# EAGLE design HackFFM-Duino Chime (EAGLE 7.4.0)
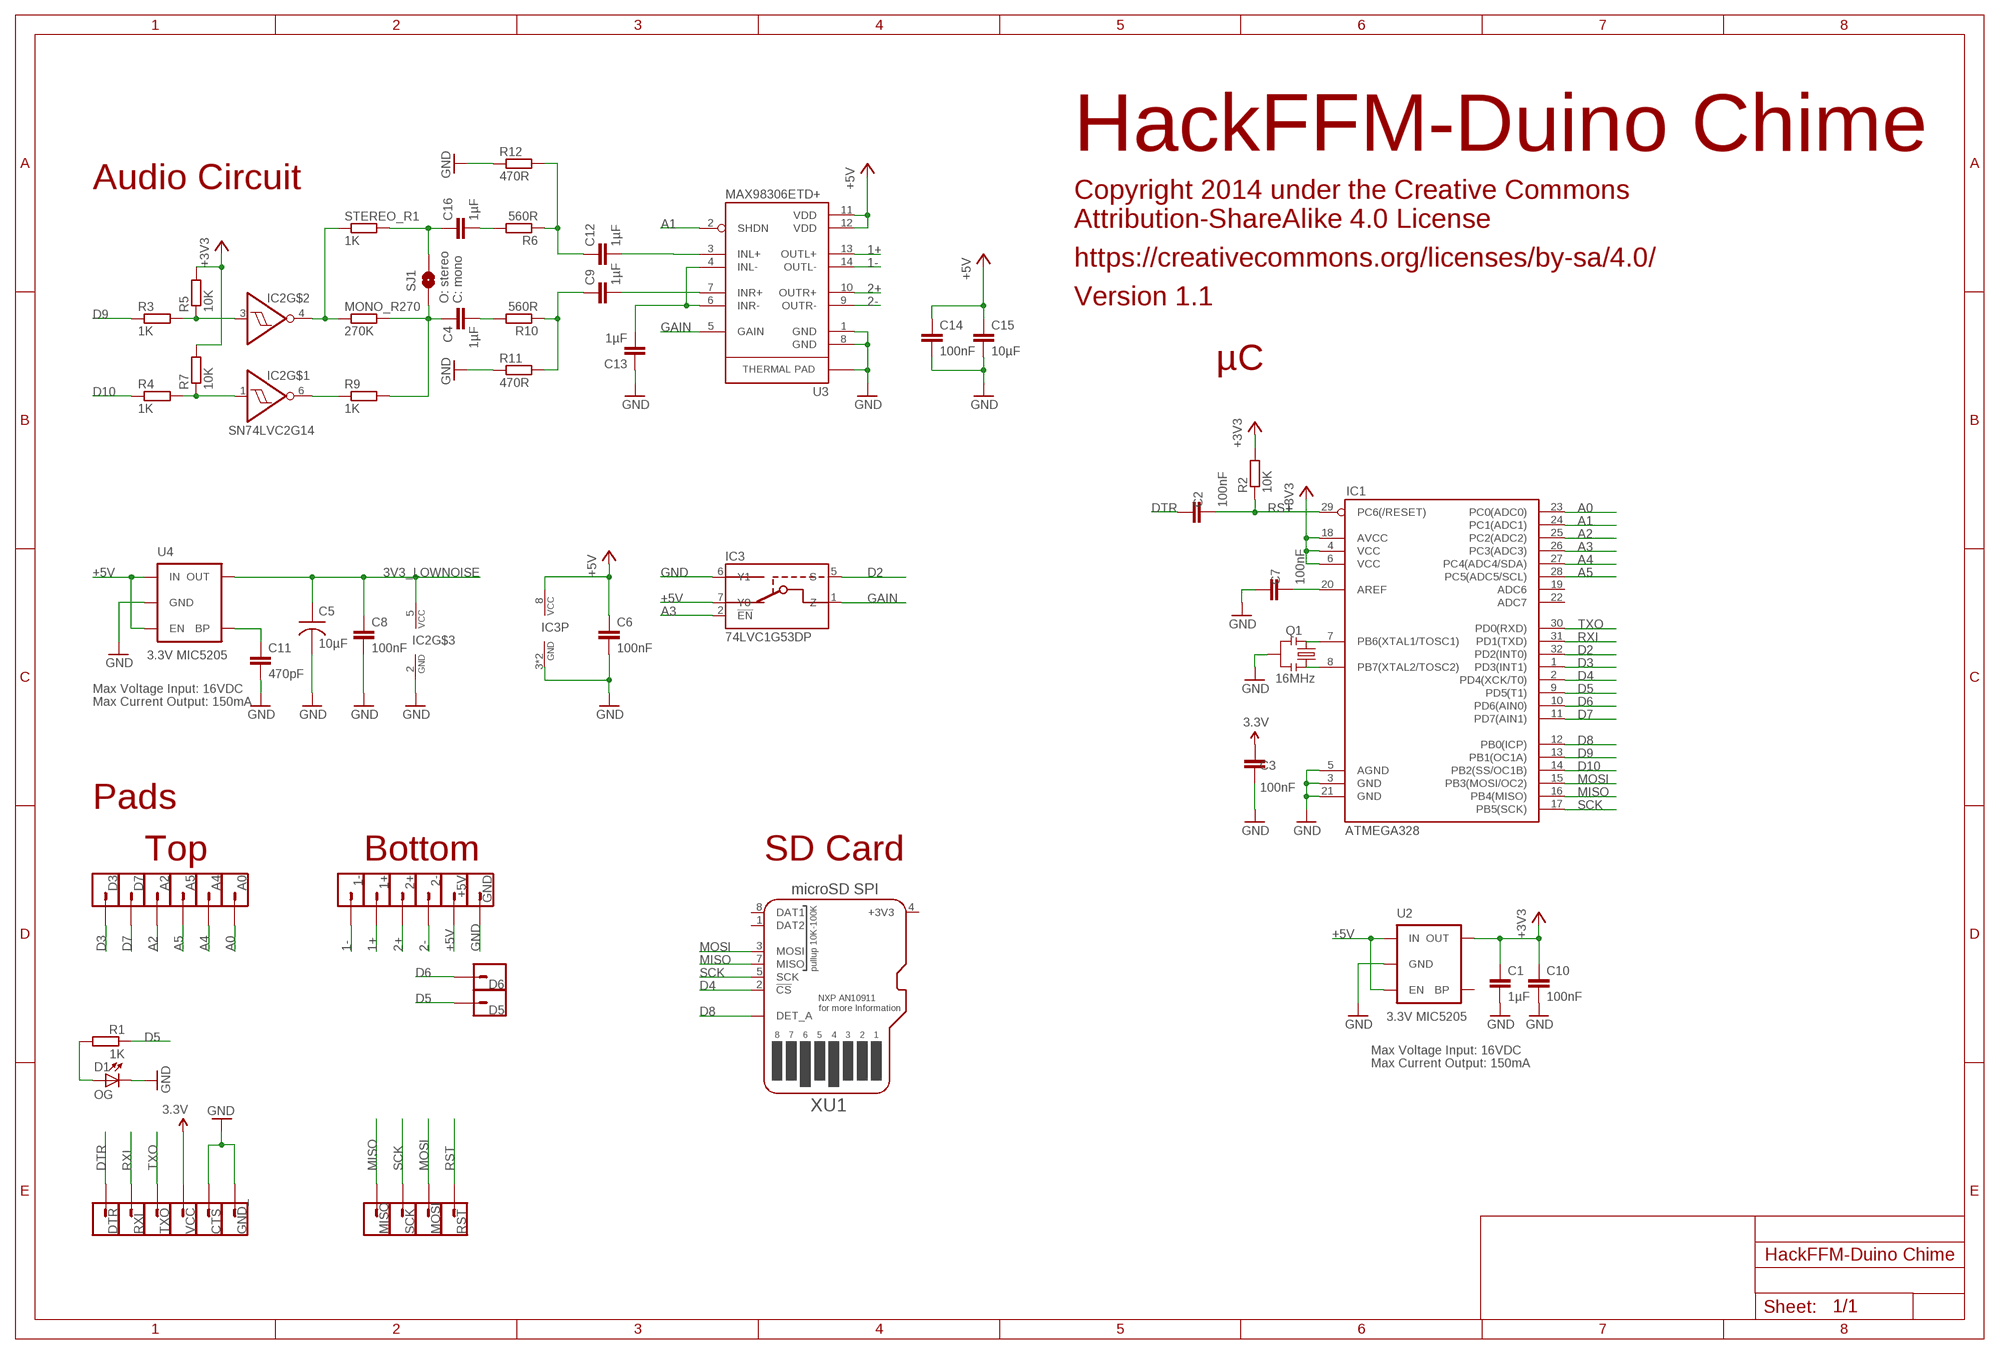
[diagram p0: schematic, sheet 1]

## Parts
1+  M01M01_SMD_EDGE_SHORT  [M01_SMD_EDGE_SHORT]
1-  M01M01_SMD_EDGE_SHORT  [M01_SMD_EDGE_SHORT]
2+  M01M01_SMD_EDGE_SHORT  [M01_SMD_EDGE_SHORT]
2-  M01M01_SMD_EDGE_SHORT  [M01_SMD_EDGE_SHORT]
+5V  M01M01_SMD_EDGE_SHORT  [M01_SMD_EDGE_SHORT]
A0  M01M01_SMD_EDGE_SHORT  [M01_SMD_EDGE_SHORT]
A2  M01M01_SMD_EDGE_SHORT  [M01_SMD_EDGE_SHORT]
A4  M01M01_SMD_EDGE_SHORT  [M01_SMD_EDGE_SHORT]
A5  M01M01_SMD_EDGE_SHORT  [M01_SMD_EDGE_SHORT]
C1  1µF  C-EUC0402  [C0402]
C2  100nF  C-EUC0402  [C0402]
C3  100nF  C-EUC0402  [C0402]
C4  1µF  C-EUC0402  [C0402]
C5  10µF  CAP-TANA-P  [TAN-A]
C6  100nF  C-EUC0402  [C0402]
C7  100nF  C-EUC0402  [C0402]
C8  100nF  C-EUC0402  [C0402]
C9  1µF  C-EUC0402  [C0402]
C10  100nF  C-EUC0402  [C0402]
C11  470pF  C-EUC0402  [C0402]
C12  1µF  C-EUC0402  [C0402]
C13  1µF  C-EUC0402  [C0402]
C14  100nF  C-EUC0402  [C0402]
C15  10µF  C-EUC0805  [C0805]
C16  1µF  C-EUC0402  [C0402]
CTS  M01M01_SMD_EDGE_XS  [M01_SMD_EDGE_XS]
D1  OG  LED0603  [LED-0603]
D3  M01M01_SMD_EDGE_SHORT  [M01_SMD_EDGE_SHORT]
D5  M01M01_SMD_EDGE_SHORT  [M01_SMD_EDGE_SHORT]
D6  M01M01_SMD_EDGE_SHORT  [M01_SMD_EDGE_SHORT]
D7  M01M01_SMD_EDGE_SHORT  [M01_SMD_EDGE_SHORT]
DTR  M01M01_SMD_EDGE_XS  [M01_SMD_EDGE_XS]
GND  M01M01_SMD_EDGE_SHORT  [M01_SMD_EDGE_SHORT]
GND_  M01M01_SMD_EDGE_XS  [M01_SMD_EDGE_XS]
IC1  ATMEGA328  ATMEGA168  [TQFP32-08]
IC2  SN74LVC2G14  [DCK_(R-PDSO-G6)]
IC3  74LVC1G53DP  [SOT-505-2]
MISO  M01M01_SMD_EDGE_XS  [M01_SMD_EDGE_XS]
MONO_R270  270K  R-EU_R0805  [R0805_NOCREAM]
MOSI  M01M01_SMD_EDGE_XS  [M01_SMD_EDGE_XS]
Q1  16MHz  RESONATORSMD  [RESONATOR-SMD]
R1  1K  R-EU_R0402  [R0402]
R2  10K  R-EU_R0402  [R0402]
R3  1K  R-EU_R0402  [R0402]
R4  1K  R-EU_R0402  [R0402]
R5  10K  R-EU_R0402  [R0402]
R6  560R  R-EU_R0402  [R0402]
R7  10K  R-EU_R0402  [R0402]
R9  1K  R-EU_R0402  [R0402]
R10  560R  R-EU_R0402  [R0402]
R11  470R  R-EU_R0402  [R0402]
R12  470R  R-EU_R0402  [R0402]
RST  M01M01_SMD_EDGE_XS  [M01_SMD_EDGE_XS]
RXI  M01M01_SMD_EDGE_XS  [M01_SMD_EDGE_XS]
SCK  M01M01_SMD_EDGE_XS  [M01_SMD_EDGE_XS]
SJ1  SOLDERJUMPERNO  [SJ_2S-NO]
STEREO_R1  1K  R-EU_R0805  [R0805_NOCREAM]
TXO  M01M01_SMD_EDGE_XS  [M01_SMD_EDGE_XS]
U2  3.3V MIC5205  V_REG_LDOSMD  [SOT23-5]
U3  MAX98306ETD+  [14-TDFN]
U4  3.3V MIC5205  V_REG_LDOSMD  [SOT23-5]
VCC  M01M01_SMD_EDGE_XS  [M01_SMD_EDGE_XS]
XU1  MICROSD_DETMOLEX104031  [MICROSD_MOLEX_104031]

## Nets
1+: 1+.P$1 U3.13(OUTL+)
1-: 1-.P$1 U3.14(OUTL-)
2+: 2+.P$1 U3.10(OUTR+)
2-: 2-.P$1 U3.9(OUTR-)
3V3_LOWNOISE: C5.1 C8.1 IC2.5(VCC) U4.5(OUT)
+3V3: C1.1 C3.2 C10.1 IC1.4(VCC) IC1.6(VCC) IC1.18(AVCC) R2.2 R5.2 R7.2 U2.5(OUT) VCC.P$1 ; supply symbol labelled 3.3V
+5V [vcc]: +5V.P$1 C6.1 C14.1 C15.1 IC3.7(Y0) IC3.8(VCC) U2.1(IN) U2.3(EN) U3.11(VDD) U3.12(VDD) U4.1(IN) U4.3(EN)
A0: A0.P$1 IC1.23(PC0(ADC0))
A1: IC1.24(PC1(ADC1)) U3.2(SHDN)
A2: A2.P$1 IC1.25(PC2(ADC2))
A3: IC1.26(PC3(ADC3)) IC3.2(!EN)
A4: A4.P$1 IC1.27(PC4(ADC4/SDA))
A5: A5.P$1 IC1.28(PC5(ADC5/SCL))
D2: IC1.32(PD2(INT0)) IC3.5(S)
D3: D3.P$1 IC1.1(PD3(INT1))
D4: IC1.2(PD4(XCK/T0)) XU1.2(!CS)
D5: D5.P$1 IC1.9(PD5(T1)) R1.1
D6: D6.P$1 IC1.10(PD6(AIN0))
D7: D7.P$1 IC1.11(PD7(AIN1))
D8: IC1.12(PB0(ICP)) XU1.DET_A
D9: IC1.13(PB1(OC1A)) R3.1
D10: IC1.14(PB2(SS/OC1B)) R4.1
DTR: C2.2 DTR.P$1
GAIN: IC3.1(Z) U3.5(GAIN)
GND [vcc]: C1.2 C3.1 C5.2 C6.2 C7.2 C8.2 C10.2 C11.2 C13.1 C14.2 C15.2 CTS.P$1 D1.C GND.P$1 GND_.P$1 IC1.3(GND) IC1.5(AGND) IC1.21(GND) IC2.2(GND) IC3.3(GND) IC3.4(GND) IC3.6(Y1) Q1.2 R11.1 R12.1 U2.2(GND) U3.1(GND) U3.8(GND) U3.15(GND) U4.2(GND)
MISO: IC1.16(PB4(MISO)) MISO.P$1 XU1.7(MISO)
MOSI: IC1.15(PB3(MOSI/OC2)) MOSI.P$1 XU1.3(MOSI)
N$1: IC1.8(PB7(XTAL2/TOSC2)) Q1.1
N$2: IC1.7(PB6(XTAL1/TOSC1)) Q1.3
N$3: D1.A R1.2
N$4: C16.2 R6.2
N$5: IC2.1(I) R4.2 R7.1
N$6: C11.1 U4.4(BP)
N$7: C12.1 R6.1 R12.2
N$8: IC2.3(I) R3.2 R5.1
N$9: IC2.6(O) R9.1
N$10: IC2.4(O) MONO_R270.1 STEREO_R1.1
N$12: C4.2 R10.2
N$13: C9.1 R10.1 R11.2
N$14: C9.2 U3.7(INR+)
N$15: C4.1 MONO_R270.2 R9.2 SJ1.1
N$17: C16.1 SJ1.2 STEREO_R1.2
N$20: C7.1 IC1.20(AREF)
N$22: C13.2 U3.4(INL-) U3.6(INR-)
N$23: C12.2 U3.3(INL+)
RST: C2.1 IC1.29(PC6(/RESET)) R2.1 RST.P$1
RXI: IC1.31(PD1(TXD)) RXI.P$1
SCK: IC1.17(PB5(SCK)) SCK.P$1 XU1.5(SCK)
TXO: IC1.30(PD0(RXD)) TXO.P$1
Unconnected: IC1.19(ADC6) IC1.22(ADC7) U2.4(BP) XU1.1(DAT2) XU1.8(DAT1)

## Notes on the sheet
- HackFFM-Duino Chime
- Audio Circuit
- Copyright 2014 under the Creative Commons
  Attribution-ShareAlike 4.0 License
- https://creativecommons.org/licenses/by-sa/4.0/
- O: stereo
  C: mono
- Version 1.1
- µC
- Max Voltage Input: 16VDC
- Max Current Output: 150mA
- Pads
- Top | Bottom | SD Card
- Max Voltage Input: 16VDC
- Max Current Output: 150mA

## Power pins joined to a net without a drawn wire
+3V3: XU1.4(+3V3)
GND: XU1.6(GND) XU1.DET_B(GND) XU1.G1(GND) XU1.G2(GND) XU1.G3(GND) XU1.G4(GND)

## Library data of the parts
1+ 1- 2+ 2- +5V A0 A2 A4 A5 CTS D3 D5-D7 DTR GND GND_ MISO MOSI RST RXI SCK TXO VCC = MyEagleLibrary:M01: Header 1 Standard 1-pin 0.1" header. Use with straight break away headers (SKU : PRT-00116), right angle break away headers (PRT-00553), swiss pins (PRT-00743), machine pins (PRT-00117), and female headers (PRT-00115).
C1-C4 C6-C16 = rcl:C-EU: CAPACITOR, European symbol
C5 = MySMD:CAP-TANA-P
D1 = SparkFun:LED: LEDs Standard schematic elements and footprints for 5mm, 3mm, 1206, and 0603 sized LEDs. 5mm - Spark Fun Electronics SKU : COM-00529 (and others)
IC1 = SparkFun:ATMEGA168
IC2 = MyEagleLibrary:SN74LVC2G14
IC3 = MyEagleLibrary:74*1G53
MONO_R270 STEREO_R1 = MyEagleLibrary:R-EU_: RESISTOR, European symbol
Q1 = SparkFun:RESONATOR: Resonator Small SMD resonator. This is the itty bitty 10/20MHz resonators with built in caps. CSTCE10M0G55 and CSTCE20M0V53. Footprint has been reviewed closely but hasn't been tested yet.
R1-R7 R9-R12 = rcl:R-EU_: RESISTOR, European symbol
SJ1 = SparkFun:SOLDERJUMPER: Solder Jumper Standard SMD solder jumper. Used to automate production. Two varients : Normally Open and Normally Closed are the same, but have different paste layers. NC will have a large amount of paste and should jumper during reflow.
U2 U4 = SparkFun:V_REG_LDO: Voltage Regulator LDO Standard 150mA LDO voltage regulator in SOT-23 layout. Micrel part MIC5205. BP (by-pass) pin is used to lower output noise with 470pF cap.
U3 = MyEagleLibrary:MAX98306: Stereo 3.7W Class D Amplifier Datasheet: http://datasheets.maxim-ic.com/en/ds/MAX98306.pdf The MAX98306 stereo 3.7W Class D amplifier provides Class AB audio performance with Class D efficiency. This device offers five selectable gain settings (6dB, 9dB, 12dB, 15dB, and 18dB) set by a single gain-select input (GAIN). Active emissions limiting, edge-rate, and overshoot control circuitry combined with a filterless spread-spectrum modulation scheme (SSM) provide excellent EMI performance while eliminating the need for output filtering found in traditional Class D devices. These features reduce application component count. The IC's 2.0mA quiescent current with a 3.7V supply extends battery life in portable applications. The IC is available in a 14-pin TDFN (3mm x 3mm x 0.75mm) package specified over the extended -40NC to +85NC temperature range.
XU1 = DCEM-microSD:MICROSD_DET

## Net classes
0 default: width 0.178 mm
1 vcc: width 0.203 mm

## Board
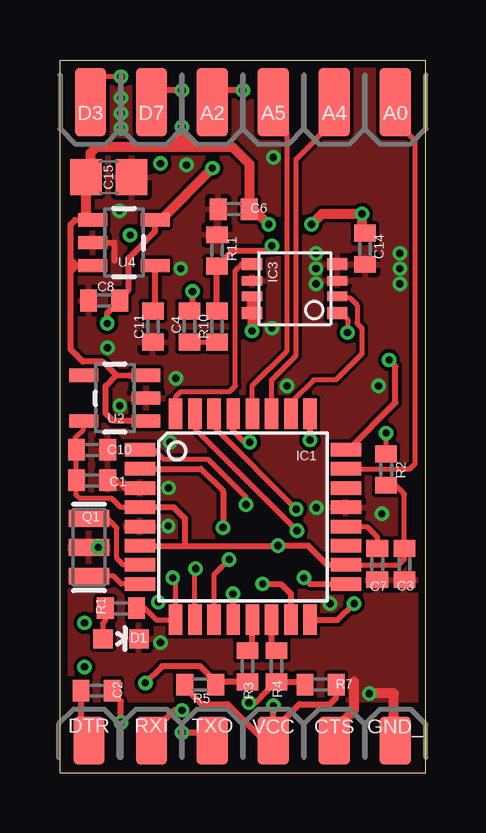
[diagram p1: board, top side]
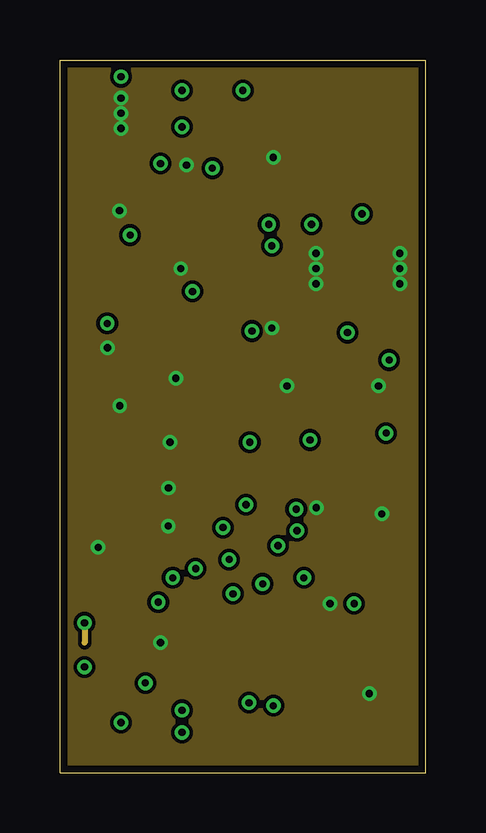
[diagram p2: board, inner layer Route2]
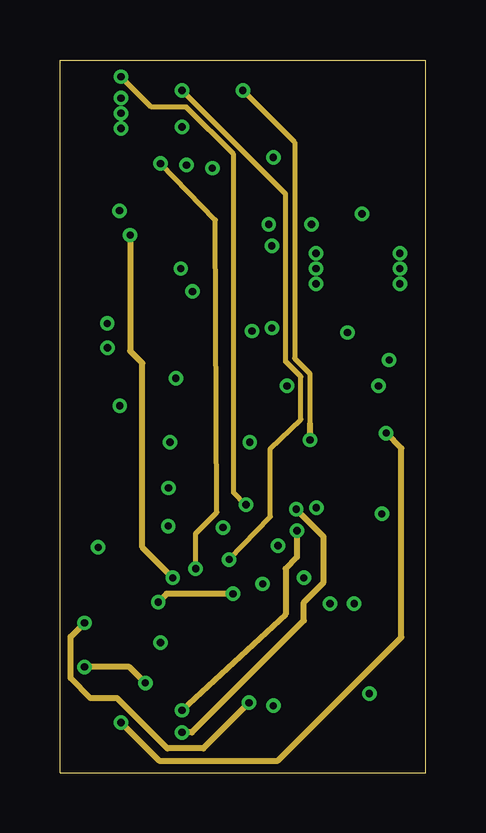
[diagram p3: board, inner layer Route15]
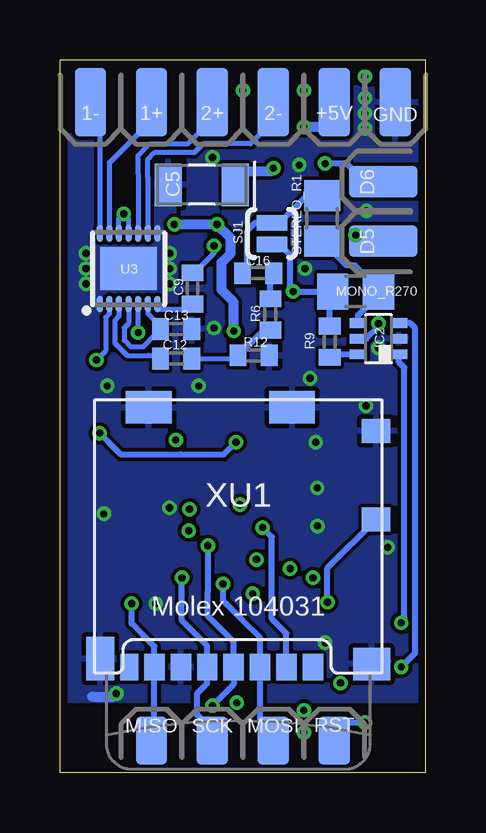
[diagram p4: board, bottom side, seen from below]

Size 15.24 x 29.72 mm. Coordinates in mm from the lower left corner, seen from the top.
Outline: 0,0 15.24,0 15.24,29.72 0,29.72 0,0
Copper layers (1+2*15+16): Top 0.035mm / dielectric 0.38mm / Route2 0.035mm / dielectric 0.71mm / Route15 0.035mm / dielectric 0.38mm / Bottom 0.035mm
Design rules "PCB-POOL Standard_ML4 *": minimum track width 0.15mm, minimum drill 0.3mm, track to track 0.15mm, track to pad 0.15mm, pad to pad 0.15mm, via to via 0.15mm, smd to smd 0.15mm, copper to edge 0.3mm, drill to drill 0.2mm, minimum pad ring 0.2mm, minimum via ring 0.15mm, stop-mask expansion 0.075mm, vias tented up to drill 0.6mm, thermal gap 0.2mm

### Footprints (pad centres in the part's own frame; a part is rotated, then mirrored left to right if it is on the bottom)
M01_SMD_EDGE_SHORT = smd 2.85 x 1.3: P$1 0.495,0
C0402 = smd 0.7 x 0.9: 1 -0.65,0; 2 0.65,0
TAN-A = smd 1.118 x 1.778: 1 0,0; 2 2.794,0
C0805 = smd 1.3 x 1.5: 1 -0.95,0; 2 0.95,0
M01_SMD_EDGE_XS = smd 2 x 1.3: P$1 0.07,0
LED-0603 = smd 0.8 x 0.8: A 0,-0.75; C 0,0.75
TQFP32-08 = smd 1.27 x 0.559: 1 -4.293,2.8; 2 -4.293,2; 3 -4.293,1.2; 4 -4.293,0.4; 5 -4.293,-0.4; 6 -4.293,-1.2; 7 -4.293,-2; 8 -4.293,-2.8; 17 4.293,-2.8; 18 4.293,-2; 19 4.293,-1.2; 20 4.293,-0.4; 21 4.293,0.4; 22 4.293,1.2; 23 4.293,2; 24 4.293,2.8 | smd 0.559 x 1.27: 9 -2.8,-4.293; 10 -2,-4.293; 11 -1.2,-4.293; 12 -0.4,-4.293; 13 0.4,-4.293; 14 1.2,-4.293; 15 2,-4.293; 16 2.8,-4.293; 25 2.8,4.293; 26 2,4.293; 27 1.2,4.293; 28 0.4,4.293; 29 -0.4,4.293; 30 -1.2,4.293; 31 -2,4.293; 32 -2.8,4.293
DCK_(R-PDSO-G6) = smd 0.4 x 0.7: 1 -0.65,-0.85; 2 0,-0.85; 3 0.65,-0.85; 4 0.65,0.85; 5 0,0.85; 6 -0.65,0.85
SOT-505-2 = smd 0.5 x 0.85: 1 -1.025,-1.775; 4 1.025,-1.775; 5 1.025,1.775; 8 -1.025,1.775 | smd 0.4 x 0.85: 2 -0.325,-1.775; 3 0.325,-1.775; 6 0.325,1.775; 7 -0.325,1.775
R0805_NOCREAM = smd 1.3 x 1.5: 1 -0.95,0; 2 0.95,0
RESONATOR-SMD = smd 0.7 x 1.7: 1 -1.2,0; 2 0,0; 3 1.2,0
R0402 = smd 0.7 x 0.9: 1 -0.65,0; 2 0.65,0
SJ_2S-NO = smd 0.635 x 1.27: 1 -0.45,0; 2 0.45,0
SOT23-5 = smd 0.55 x 1.2: 1 -0.95,-1.3; 2 0,-1.3; 3 0.95,-1.3; 4 0.95,1.3; 5 -0.95,1.3
14-TDFN = smd 0.7 x 0.25: 1 -1.475,1.2; 2 -1.475,0.8; 3 -1.475,0.4; 4 -1.475,0; 5 -1.475,-0.4; 6 -1.475,-0.8; 7 -1.475,-1.2; 8 1.475,-1.2; 9 1.475,-0.8; 10 1.475,-0.4; 11 1.475,0; 12 1.475,0.4; 13 1.475,0.8; 14 1.475,1.2 | smd 1.78 x 2.35: 15 0,0
MICROSD_MOLEX_104031 = smd 0.85 x 1.1: 1 -3.105,-0.85; 2 -2.005,-0.85; 3 -0.905,-0.85; 4 0.195,-0.85; 5 1.295,-0.85; 6 2.395,-0.85; 7 3.495,-0.85 | smd 0.75 x 1.1: 8 4.545,-0.85 | smd 1.2 x 1: DET_A -5.74,-7; DET_B -5.74,-10.7 | smd 1.55 x 1.35: G1 -5.565,-0.975 | smd 1.17 x 1.8: G2 5.755,-1.2 | smd 1.9 x 1.35: G3 3.73,-11.675; G4 -2.24,-11.675

### Placement (x,y rotation side)
1+  11.43,28.45 270 bottom
1-  13.97,28.45 270 bottom
2+  8.89,28.45 270 bottom
2-  6.35,28.45 270 bottom
+5V  3.81,28.45 270 bottom
A0  13.97,28.45 270 top
A2  6.35,28.45 270 top
A4  11.43,28.45 270 top
A5  8.89,28.45 270 top
C1  1.33,12.19 0 top
C2  1.52,3.43 180 top
C3  14.35,8.7 90 top
C4  5.4,18.61 270 top
C5  7.94,24.51 180 bottom
C6  7.24,23.5 180 top
C7  13.22,8.7 270 top
C8  1.84,19.68 180 top
C9  9.72,20.19 270 bottom
C10  1.33,13.46 0 top
C11  3.87,18.61 270 top
C12  10.4,17.27 180 bottom
C13  10.4,18.5 180 bottom
C14  12.71,21.84 270 top
C15  2.03,24.83 0 top
C16  6.99,20.83 0 bottom
CTS  11.43,1.27 90 top
D1  2.54,5.59 270 top
D3  1.27,28.45 270 top
D5  1.27,22.16 180 bottom
D6  1.27,24.64 180 bottom
D7  3.81,28.45 270 top
DTR  1.21,1.27 90 top
GND  1.27,28.45 270 bottom
GND_  13.97,1.27 90 top
IC1  7.62,10.67 0 top
IC2  1.97,18.1 90 bottom
IC3  9.78,20.19 90 top
MISO  11.43,1.27 90 bottom
MONO_R270  2.92,20.07 180 bottom
MOSI  6.35,1.27 90 bottom
Q1  1.21,9.4 90 top
R1  2.54,6.86 180 top
R2  13.59,12.64 270 top
R3  7.81,4.45 270 top
R4  9.02,4.45 270 top
R5  5.84,3.68 180 top
R6  6.48,19.11 90 bottom
R7  10.86,3.68 0 top
R9  4,17.97 90 bottom
R10  6.54,18.61 270 top
R11  6.54,21.78 270 top
R12  7.18,17.4 180 bottom
RST  3.81,1.27 90 bottom
RXI  3.81,1.27 90 top
SCK  8.89,1.27 90 bottom
SJ1  6.41,22.48 90 bottom
STEREO_R1  4.32,23.11 90 bottom
TXO  6.35,1.27 90 top
U2  2.29,15.62 90 top
U3  12.38,21.02 90 bottom
U4  2.67,22.1 270 top
VCC  8.89,1.27 90 top
XU1  7.81,3.56 180 bottom

### Tracks (layer width: path | path; a pad name or v marks a point on that pad's centre or on a via)
1+
  Bottom 0.203: 1+.P$1 11.43,27.18 13.18,25.43 U3.13
1-
  Bottom 0.203: 1-.P$1 13.58,27.57 U3.14
2+
  Bottom 0.203: 9.01,27.95 2+.P$1 8.89,27.24 9.91,26.23 11.49,26.23 11.98,25.74 11.98,24.97 U3.10
2-
  Bottom 0.203: 6.35,27.56 2-.P$1 6.35,27.18 7.3,26.23 9.27,26.23 9.65,25.84 11.3,25.84 11.58,25.57 11.58,24.8 U3.9
3V3_LOWNOISE  (via drill 0.3)
  Top 0.254: v1.97,18.73 1.97,19.16 C8.1 2.48,19.75 2.86,20.13 2.86,21.46 3.97,22.57 U4.5
  Top 0.406: 4.32,23.05 4.19,23.05 | v6.35,25.21 4.19,23.05 | 4.19,23.05 U4.5
  Bottom 0.254: IC2.5 2.48,18.1 1.97,18.61 v1.97,18.73
  Bottom 0.406: C5.1 7.81,25.02 7.75,25.08 6.48,25.08 v6.35,25.21
+3V3  (via drill 0.3)
  Top 0.203: U2.5 0.99,14.32 0.64,13.97 0.64,13.22 C10.1 C1.1 0.68,11.57 0.83,11.43 2.16,11.43 2.52,11.07 IC1.4 | IC1.18 14.13,8.67 14.35,8.89 C3.2 14.35,11.62 13.98,11.99 R2.2
  Top 0.254: IC1.4 4.74,11.07 5.21,10.6 5.21,9.47 | IC1.6 5.21,9.47 | IC1.18 11.14,8.67 10.34,9.47 v9.08,9.47 5.21,9.47 | 11.51,3.62 R7.2 11.51,3.13 11.24,2.86 9.97,2.86 8.89,1.78 | 8.89,1.78 v8.89,2.79 | 8.89,1.78 VCC.P$1 8.5,1.34 7.62,2.22 6.99,2.86 6.02,2.86 5.91,2.86 5.59,3.17 5.19,3.57 R5.2
  Bottom 0.254: v9.08,9.47 9.08,7.56 9.08,6.54 8.89,6.35 8.01,5.46 XU1.4 8.01,3.68 v8.89,2.79
+5V  (via drill 0.3)
  Top 0.203: 3.62,14.67 U2.1
  Top 0.254: 3.62,14.67 2.22,14.67 1.91,14.99 1.91,16.13 2.35,16.57 | 2.35,16.57 2.85,16.57 U2.3 | 2.35,16.57 1.78,17.14 0.95,17.14 0.45,17.65 0.45,20.9 | U4.3 0.7,21.15 | 0.7,21.15 0.45,21.4 | 0.45,21.4 0.45,22.86 0.64,23.05 1.24,23.05 U4.1 1.71,23.05 | 0.45,20.9 0.7,21.15 | 0.45,20.9 0.45,21.4
  Top 0.406: IC3.8 IC3.7 8,19.8 v8,18.41 | C14.1 12.58,22.43 v12.58,23.3 10.92,23.3 v10.48,22.86 | U4.1 1.08,23.05 C15.1 1.27,24.83 1.27,25.34 1.27,25.85 1.52,26.1 4.7,26.1 | 4.7,26.1 5.46,26.1 | 5.46,26.1 7.18,26.1 7.89,25.39 C6.1 7.94,23.62 v8.7,22.86 | v5.08,26.92 5.08,26.48 | 5.08,26.48 5.46,26.1 | 4.7,26.1 5.08,26.48
  Bottom 0.203: U3.12 12.78,23.11 v12.58,23.3 12.38,23.11 U3.11
  Bottom 0.406: v10.48,22.86 v8.7,22.86 8.13,22.29 8.13,21.65 8.51,21.27 8.51,20.13 8,19.62 v8,18.41 | +5V.P$1 3.81,26.92 v5.08,26.92
A0
  Top 0.203: IC1.23 14.57,12.67 14.8,12.89 14.8,26.35 13.97,27.18 A0.P$1
A1  (via drill 0.3)
  Top 0.203: IC1.24 11.68,13.47
  Top 0.254: IC1.24 12.01,13.47 13.97,15.43 13.97,16.95 v13.72,17.21
  Bottom 0.203: U3.2 13.18,19.14 13.34,18.99 13.34,17.59 v13.72,17.21
A2  (via drill 0.3)
  Top 0.254: v7.62,28.45 6.35,28.45 A2.P$1 | IC1.25 v10.41,13.88
  Route15 0.203: v7.62,28.45 9.78,26.29 9.78,17.27 10.41,16.64 10.41,14.54
  Route15 0.254: 10.41,14.54 v10.41,13.88
A3
  Top 0.203: IC1.26 9.78,14.96 9.78,15.6 10.57,16.38 11.49,16.38 12.57,17.46 12.57,18.54 12.38,18.73 12.38,19.49 12.07,19.8 IC3.2
A4
  Top 0.203: IC1.27 8.82,16.38 9.84,17.4 9.84,25.59 11.43,27.18 A4.P$1
A5
  Top 0.203: IC1.28 8.02,16.15 9.46,17.59 9.46,26.67 8.89,27.24 A5.P$1
D2
  Top 0.203: IC1.32 4.82,15.68 5.02,15.88 7.05,15.88 7.3,16.13 7.3,20.95 7.57,21.22 IC3.5
D3  (via drill 0.3)
  Top 0.203: IC1.1 3.93,13.47 4.32,13.08 6.16,13.08 7.75,11.49 v7.75,11.18 | v2.54,29.02 1.27,29.02 D3.P$1
  Route15 0.203: v7.75,11.18 7.24,11.68 7.24,25.78 5.27,27.75 3.81,27.75 v2.54,29.02
D4  (via drill 0.3)
  Top 0.254: IC1.2 5.87,12.67 6.79,11.75 v6.79,10.22
  Bottom 0.254: v6.79,10.22 6.41,9.84 6.41,9.83 6.41,6.92 6.41,6.41 6.35,6.35 5.81,5.81 XU1.2
D5  (via drill 0.3)
  Top 0.203: v4.7,8.13 4.82,8.01 IC1.9 4.01,6.38 3.52,6.86 R1.1
  Route15 0.254: v2.92,22.42 2.92,17.59 3.43,17.08 3.43,9.4 v4.7,8.13
  Bottom 0.254: D5.P$1 2.08,22.42 v2.92,22.42
D6  (via drill 0.3)
  Top 0.203: IC1.10 5.62,8.48 v5.65,8.51
  Route15 0.203: v5.65,8.51 5.65,9.97 6.54,10.86 6.48,23.05 v4.19,25.4
  Bottom 0.254: D6.P$1 2.54,24.64 3.17,25.27 3.3,25.4 v4.19,25.4
D7  (via drill 0.3)
  Top 0.203: IC1.11 6.42,8.26 v7.05,8.89
  Top 0.254: v5.08,28.45 3.81,28.45 D7.P$1
  Route15 0.203: v7.05,8.89 8.76,10.67 8.76,13.53 10.03,14.73 10.03,16.51 9.4,17.14 9.4,24.13 v5.08,28.45
D8  (via drill 0.3)
  Top 0.254: IC1.12 v7.22,7.45 v7.21,7.46
  Route15 0.254: v7.21,7.46 4.45,7.46 v4.1,7.11
  Bottom 0.254: v4.1,7.11 4.1,8.53 XU1.DET_A
D9
  Top 0.254: R3.1 8.02,5.09 IC1.13
D10
  Top 0.254: R4.1 8.82,5.09 IC1.14
DTR
  Top 0.254: C2.2 0.87,2.17
  Top 0.406: 0.87,2.17 0.87,1.34 DTR.P$1
GAIN  (via drill 0.3)
  Top 0.203: IC3.1 11.79,19.11 11.98,18.91 v11.98,18.35
  Bottom 0.203: v11.98,18.35 U3.5
GND  (via drill 0.3)
  Top 0.203: C1.2 2.35,12.19 2.67,11.87 IC1.3 | 3.58,15.63 3.81,15.75 U2.2
  Top 0.254: 2.26,21.34 2.26,22.1 U4.2
  Top 0.406: GND_.P$1 13.91,1.07 13.91,3.3 v12.89,3.3 | CTS.P$1 11.43,1.78 12.26,2.6 12.26,3.81
  Bottom 0.406: 13.91,3.18 13.84,3.17 13.02,3.17 v12.89,3.3
  other vias: 1.59,9.4 10.67,21.02 10.67,21.65 10.67,20.38 14.16,21.02 14.16,20.38 14.16,21.65 5.27,25.34 4.19,5.42 4.51,10.29 2.49,15.3 4.58,13.78 4.52,11.87 10.68,11.05 8.83,18.54 4.83,16.45 9.46,16.13 13.27,16.13 13.41,10.79 11.25,7.05 1.98,17.72 8.89,25.65 2.48,23.43 2.54,28.13 2.54,27.5 5.03,21.02 2.54,26.86
  pour Top: 0,29.72 15.24,29.72 15.18,3.05 -0.06,3.05
  pour Bottom: 0,29.72 15.24,29.72 15.18,3.05 -0.06,3.05
  pour Bottom (no thermals): 14.16,18.54 10.48,18.67 10.48,23.75 14.16,23.62
  pour Route2: 0,29.72 0,-0.76 15.24,-0.76 15.24,29.72
MISO  (via drill 0.3)
  Top 0.254: IC1.16 11.58,6.38 v12.26,7.05
  Bottom 0.254: MISO.P$1 11.43,1.78 11.31,1.9 XU1.7 11.31,5.27 11.81,5.78 12.26,6.22 v12.26,7.05
MOSI  (via drill 0.3)
  Top 0.254: v8.45,7.87 9.21,7.87 9.62,7.46 IC1.15
  Bottom 0.254: MOSI.P$1 6.35,1.71 6.91,2.27 XU1.3 6.91,5.64 7.62,6.35 8.45,7.18 v8.45,7.87
N$1
  Top 0.203: IC1.8 2.55,7.87 2.22,8.2 Q1.1
N$2
  Top 0.203: Q1.3 1.98,10.6 2.38,10.2 2.38,8.93 2.63,8.67 IC1.7
N$3
  Top 0.203: R1.2 1.89,6.33 1.78,6.22 1.78,5.6 D1.A
N$4
  Bottom 0.254: R6.2 6.48,20.38 6.33,20.53 | 6.29,20.57 6.33,20.53 | 6.33,20.53 C16.2
N$5  (via drill 0.3)
  Top 0.254: R7.1 10.21,3.79 R4.2 9,3.79 8.64,3.43 8.13,2.92 v7.87,2.92
  Route2 0.254: v1.02,6.25 1.02,5.42
  Route15 0.254: v7.87,2.92 5.97,1.02 4.48,1.02 2.95,2.54 2.38,3.11 1.27,3.11 0.45,3.94 0.45,5.4 0.45,5.67 v1.02,6.25
  Bottom 0.254: IC2.1 1.12,17.12 0.89,16.89 0.89,6.45 v1.02,6.25
N$6
  Top 0.254: C11.1 3.97,19.41 U4.4
N$7
  Bottom 0.203: C12.1 7.87,17.27 7.81,17.34 R12.2 7.83,17.5 7.62,17.59
  Bottom 0.254: 7.62,17.59 6.92,18.29 6.53,18.29 R6.1
N$8  (via drill 0.3)
  Top 0.254: R3.2 6.49,3.79 | 6.49,3.79 R5.1 | 6.49,3.79 5.84,4.45 4.25,4.45 v3.56,3.75
  Route15 0.254: v3.56,3.75 2.89,4.41 v1.02,4.41
  Bottom 0.254: IC2.3 0.65,18.75 0.45,18.54 0.45,6.35 0.45,4.99 v1.02,4.41
N$9
  Bottom 0.254: R9.1 3.84,17.45 IC2.6
N$10
  Bottom 0.203: MONO_R270.1 1.98,20.59
  Bottom 0.254: IC2.4 2.82,19.09 1.97,19.94 MONO_R270.1 | 1.98,20.59 2.4,20.59 2.95,21.14 3.3,21.14 4.19,22.04 STEREO_R1.1
N$12
  Top 0.203: C4.2 R10.2
N$13  (via drill 0.3)
  Top 0.254: R10.1 R11.2 7.19,21.78 8.64,21.78 v8.83,21.97
  Bottom 0.203: C9.1 9.64,20.84 8.83,21.65 v8.83,21.97
N$14
  Bottom 0.203: C9.2 9.95,19.3 11.18,19.3 U3.7
N$15  (via drill 0.3)
  Top 0.254: C4.1 5.52,19.38 v5.52,20.07
  Bottom 0.254: R9.2 4,19.81 MONO_R270.2 v5.52,20.07 5.65,20.19 5.65,21.21 5.65,21.59 5.78,21.72 6.09,22.03 SJ1.1
N$17
  Bottom 0.254: C16.1 7.43,20.77 7.43,22.61 7.11,22.93 SJ1.2 6.09,22.93 4.96,24.06 STEREO_R1.2
N$20
  Top 0.203: IC1.20 12.78,10.27 13.22,9.83 C7.1
N$22
  Bottom 0.203: U3.6 11.58,19.14 11.3,18.86 11.3,18.48 | 11.3,18.48 11.3,18.22 11.75,17.78 12.32,17.78 12.57,18.03 12.57,18.54 12.38,18.73 U3.4 | C13.2 11.22,18.5 11.3,18.48
N$23
  Bottom 0.203: U3.3 12.78,19.03 12.95,18.86 12.95,17.91 12.45,17.4 11.56,17.4 11.26,17.4 C12.2
RST  (via drill 0.3)
  Top 0.203: R2.1 v13.59,14.16
  Top 0.254: v7.91,13.78 7.68,13.78 7.22,14.24 IC1.29 | v2.54,2.1 2.54,2.98 2.35,3.17 2.35,3.25 C2.1
  Route15 0.254: v2.54,2.1 4.13,0.51 9.08,0.51 14.22,5.65 14.22,13.53 v13.59,14.16
  Bottom 0.203: 13.4,13.97 v13.59,14.16
  Bottom 0.254: v2.54,2.1 3.81,2.1 RST.P$1 3.81,1.73 | v13.59,14.16 13.21,13.78 12.7,13.27 10.22,13.27 8.41,13.27 v7.91,13.78
RXI  (via drill 0.3)
  Top 0.203: IC1.31 5.62,14.35 v9.87,10.1
  Top 0.254: v5.08,2.6 4.76,2.6 4.19,2.03 3.81,1.65 RXI.P$1
  Route15 0.254: v9.87,10.1 9.87,8.99 9.4,8.51 9.4,6.6 v5.08,2.6
SCK  (via drill 0.3)
  Top 0.254: v10.16,8.13 10.42,7.87 IC1.17
  Bottom 0.254: SCK.P$1 8.89,1.78 9.53,2.41 9.53,3.3 9.11,3.72 XU1.5 9.11,5.29 10.16,6.35 v10.16,8.13
TXO  (via drill 0.3)
  Top 0.203: IC1.30 6.42,14.41 v9.84,10.99
  Top 0.254: v5.08,1.68 6.35,1.68 TXO.P$1
  Route15 0.254: v9.84,10.99 10.99,9.84 10.99,7.94 10.16,7.11 10.16,6.35 5.49,1.68 v5.08,1.68

### Text on the board
tStop: hackffm.de
bStop: hackffm.de